# EAGLE design sense-amp (EAGLE 6.6.0)
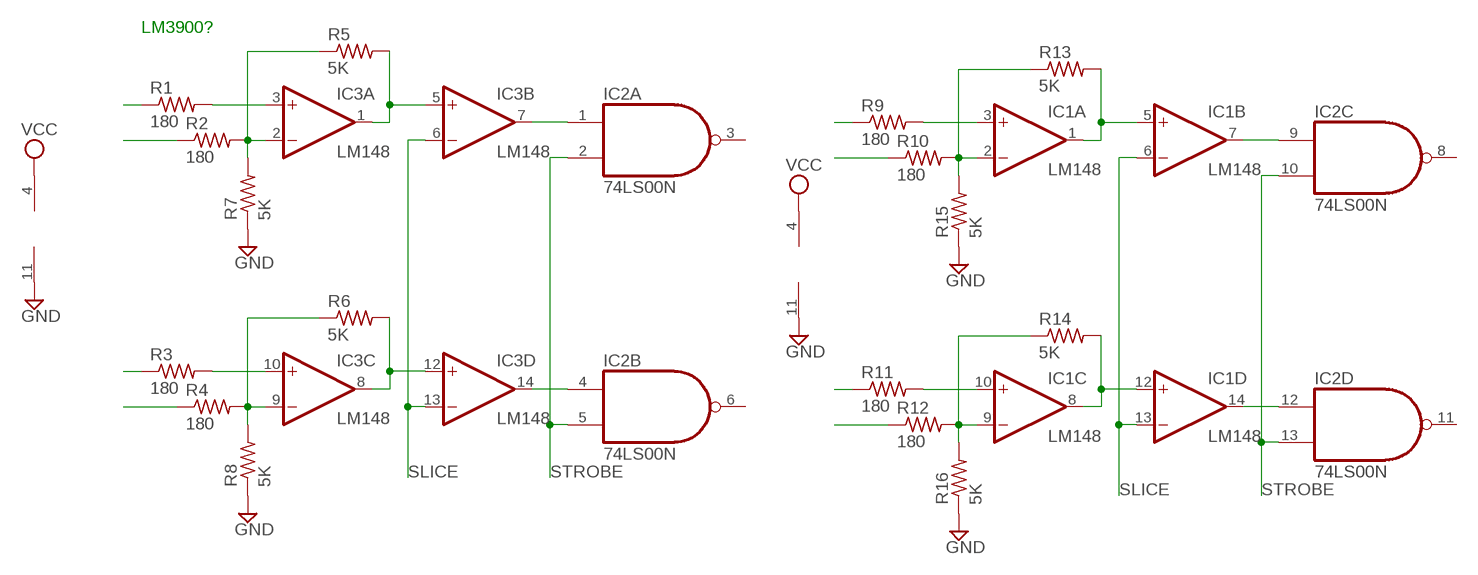
[diagram p0: schematic, sheet 1]

## Parts
IC1  LM148  OP11P  [DIL14]
IC2  74LS00N  [DIL14]
IC3  LM148  OP11P  [DIL14]
R1  180  R-US_0207/10  [0207/10]
R2  180  R-US_0207/10  [0207/10]
R3  180  R-US_0207/10  [0207/10]
R4  180  R-US_0207/10  [0207/10]
R5  5K  R-US_0207/10  [0207/10]
R6  5K  R-US_0207/10  [0207/10]
R7  5K  R-US_0207/10  [0207/10]
R8  5K  R-US_0207/10  [0207/10]
R9  180  R-US_0207/10  [0207/10]
R10  180  R-US_0207/10  [0207/10]
R11  180  R-US_0207/10  [0207/10]
R12  180  R-US_0207/10  [0207/10]
R13  5K  R-US_0207/10  [0207/10]
R14  5K  R-US_0207/10  [0207/10]
R15  5K  R-US_0207/10  [0207/10]
R16  5K  R-US_0207/10  [0207/10]

## Nets
GND: IC1.11(P:V-) IC3.11(P:V-) R7.1 R8.1 R15.1 R16.1
N$1: IC3.8(C:OUT) IC3.12(D:+IN) R6.2
N$2: IC3.1(A:OUT) IC3.5(B:+IN) R5.2
N$3: R1.1
N$4: R2.1
N$5: R3.1
N$6: R4.1
N$7: IC3.9(C:-IN) R4.2 R6.1 R8.2
N$8: IC3.10(C:+IN) R3.2
N$9: IC3.2(A:-IN) R2.2 R5.1 R7.2
N$10: IC3.3(A:+IN) R1.2
N$11: IC1.8(C:OUT) IC1.12(D:+IN) R14.2
N$12: IC1.1(A:OUT) IC1.5(B:+IN) R13.2
N$13: R9.1
N$14: R10.1
N$15: R11.1
N$16: R12.1
N$17: IC1.9(C:-IN) R12.2 R14.1 R16.2
N$18: IC1.10(C:+IN) R11.2
N$19: IC1.2(A:-IN) R10.2 R13.1 R15.2
N$20: IC1.3(A:+IN) R9.2
N$21: IC2.1(A:I0) IC3.7(B:OUT)
N$22: IC2.4(B:I0) IC3.14(D:OUT)
N$23: IC1.14(D:OUT) IC2.12(D:I0)
N$24: IC1.7(B:OUT) IC2.9(C:I0)
SLICE: IC1.6(B:-IN) IC1.13(D:-IN) IC3.6(B:-IN) IC3.13(D:-IN)
STROBE: IC2.2(A:I1) IC2.5(B:I1) IC2.10(C:I1) IC2.13(D:I1)
VCC: IC1.4(P:V+) IC3.4(P:V+)
Unconnected: IC2.3(A:O) IC2.6(B:O) IC2.8(C:O) IC2.11(D:O)

## Notes on the sheet
- LM3900?

## Power pins joined to a net without a drawn wire
GND: IC2.7(P:GND)
VCC: IC2.14(P:VCC)

## Library data of the parts
IC1 IC3 = linear:OP11: Quad Low-Offset Low-Power OP AMP The OP-11 is pin compatible with the OP-400 , LM148, HA4741, RM4156, and LT1014 operational amplifiers source http://products.analog.com/products/info.asp?product=OP400
IC2 = 74xx-us:74*00: Quad 2-input NAND gate
R1-R16 = rcl:R-US_: RESISTOR, American symbol

## Board
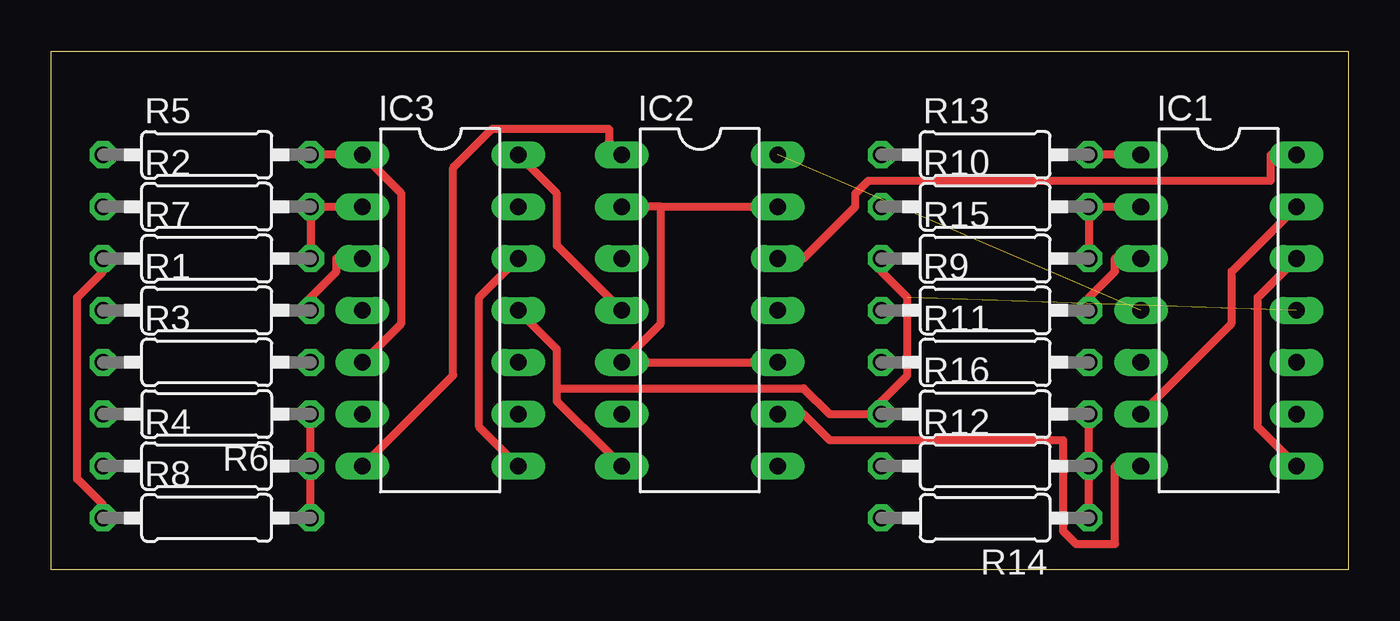
[diagram p1: board, top side]
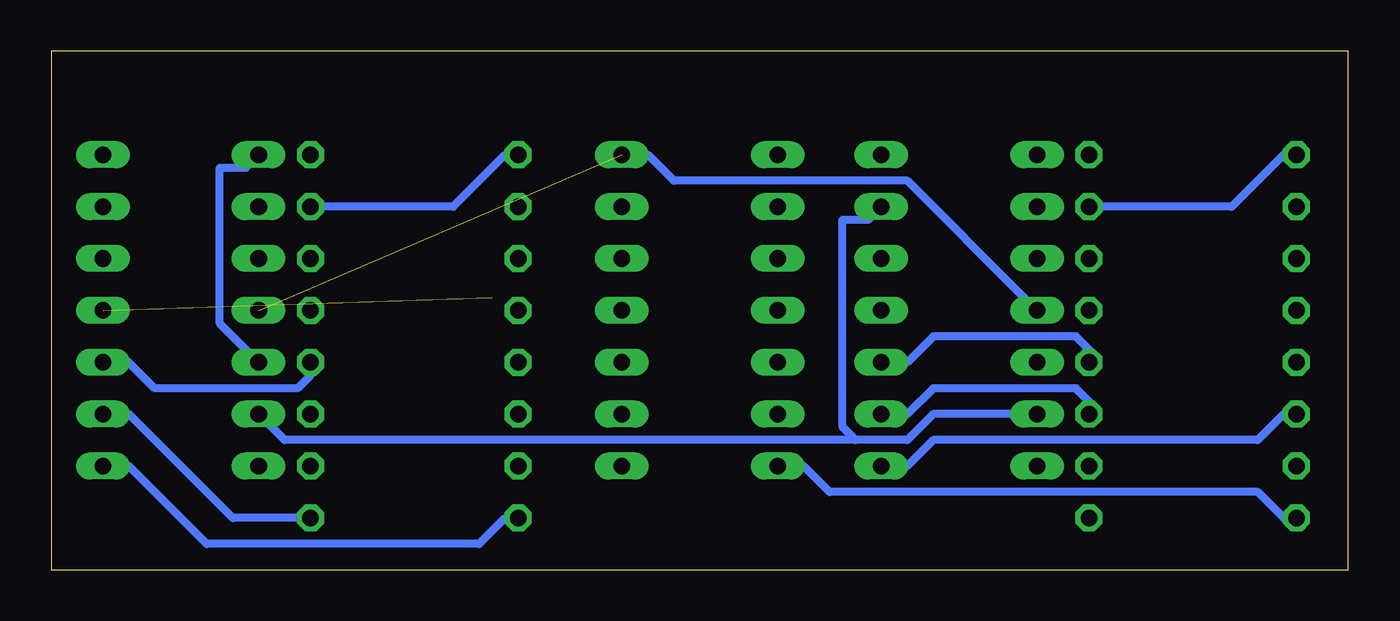
[diagram p2: board, bottom side, seen from below]

Size 63.5 x 25.4 mm. Coordinates in mm from the lower left corner, seen from the top.
Outline: 0,0 0,25.4 63.5,25.4 63.5,0 0,0
Copper layers (1*16): Top 0.035mm / dielectric 1.5mm / Bottom 0.035mm
Design rules "15mils": minimum track width 15mil, minimum drill 24mil, track to track 15mil, track to pad 10mil, pad to pad 10mil, via to via 10mil, smd to smd 10mil, copper to edge 25mil, drill to drill 10mil, minimum pad ring 10mil, minimum via ring 8mil, stop-mask expansion 0mil, vias tented up to drill 0mil, thermal gap 10mil

### Footprints (pad centres in the part's own frame; a part is rotated, then mirrored left to right if it is on the bottom)
DIL14 = drill 0.813 long: 1 -7.62,-3.81; 2 -5.08,-3.81; 3 -2.54,-3.81; 4 0,-3.81; 5 2.54,-3.81; 6 5.08,-3.81; 7 7.62,-3.81; 8 7.62,3.81; 9 5.08,3.81; 10 2.54,3.81; 11 0,3.81; 12 -2.54,3.81; 13 -5.08,3.81; 14 -7.62,3.81
0207/10 = drill 0.813 octagon: 1 -5.08,0; 2 5.08,0

### Placement (x,y rotation side)
IC1  57.15,12.7 270 top
IC2  31.75,12.7 270 top
IC3  19.05,12.7 270 top
R1  7.62,12.7 0 top
R2  7.62,17.78 0 top
R3  7.62,10.16 0 top
R4  7.62,5.08 0 top
R5  7.62,20.32 0 top
R6  7.62,7.62 180 top
R7  7.62,15.24 0 top
R8  7.62,2.54 0 top
R9  45.72,12.7 0 top
R10  45.72,17.78 0 top
R11  45.72,10.16 0 top
R12  45.72,5.08 0 top
R13  45.72,20.32 0 top
R14  45.72,2.54 180 top
R15  45.72,15.24 0 top
R16  45.72,7.62 0 top

### Tracks (layer width: path | path; a pad name or v marks a point on that pad's centre or on a via)
GND  (1 unrouted)
  Top 0.381: R8.1 2.54,3.17 1.27,4.45 1.27,13.34 2.54,14.61 R7.1 | R15.1 40.64,14.61 41.91,13.34 41.91,9.53 40.64,8.26 R16.1 40.01,7.62 38.1,7.62 36.83,8.89 24.77,8.89 | 24.77,8.89 24.77,10.79 23.5,12.06 IC3.11 | 24.77,8.89 24.77,8.26 27.3,5.71 IC2.7
  Bottom 0.381: R8.1 3.17,2.54 4.45,3.81 25.4,3.81 26.67,5.08 IC2.7
N$1
  Top 0.381: IC3.12 22.23,14.61 20.95,13.34 20.95,6.99 22.23,5.71 IC3.8
  Bottom 0.381: R6.2 3.17,7.62 4.45,6.35 20.32,6.35 21.59,5.08 IC3.8
N$2
  Top 0.381: R5.2 13.34,20.32 13.97,20.32 IC3.1 15.88,19.68 17.14,18.41 17.14,12.06 15.88,10.79 IC3.5
N$7
  Top 0.381: R8.2 12.7,3.17 12.7,4.45 R4.2 12.7,5.71 12.7,6.99 R6.1
  Bottom 0.381: IC3.9 21.59,7.62 20.32,8.89 13.34,8.89 12.7,8.26 R6.1
N$8
  Bottom 0.381: R3.2 12.7,10.79 13.34,11.43 20.32,11.43 21.59,10.16 IC3.10
N$9
  Top 0.381: R7.2 12.7,15.88 12.7,17.14 R2.2 13.34,17.78 13.97,17.78 IC3.2
  Bottom 0.381: R5.1 3.17,20.32 5.71,17.78 12.06,17.78 R2.2
N$10
  Top 0.381: R1.2 12.7,13.34 13.97,14.61 13.97,15.24 IC3.3
N$11
  Top 0.381: IC1.12 60.33,14.61 59.05,13.34 59.05,6.99 60.33,5.71 IC1.8
  Bottom 0.381: R14.2 41.27,2.54 42.55,1.27 55.88,1.27 59.69,5.08 IC1.8
N$12
  Top 0.381: R13.2 51.44,20.32 52.07,20.32 IC1.1
  Bottom 0.381: IC1.5 53.98,10.79 55.24,12.06 55.24,19.68 53.98,19.68 IC1.1
N$17
  Top 0.381: R14.1 50.8,3.17 50.8,4.45 R12.2 50.8,5.71 50.8,6.99 R16.2
  Bottom 0.381: IC1.9 59.69,7.62 54.61,2.54 51.44,2.54 R14.1
N$18
  Bottom 0.381: R11.2 50.8,9.53 51.44,8.89 58.42,8.89 59.69,10.16 IC1.10
N$19
  Top 0.381: R15.2 50.8,15.88 50.8,17.14 R10.2 51.44,17.78 52.07,17.78 IC1.2
  Bottom 0.381: R13.1 41.27,20.32 43.81,17.78 50.16,17.78 R10.2
N$20
  Top 0.381: R9.2 50.8,13.34 52.07,14.61 52.07,15.24 IC1.3
N$21
  Top 0.381: IC3.7 15.88,5.71 19.68,9.53 19.68,19.68 21.59,21.59 27.3,21.59 27.3,20.95 IC2.1
N$22
  Top 0.381: IC2.4 27.3,13.34 24.77,15.88 24.77,18.41 23.5,19.68 IC3.14
N$23
  Top 0.381: IC2.12 36.83,15.24 39.37,17.78 39.37,18.41 40.01,19.05 59.69,19.05 59.69,20.32 IC1.14
N$24
  Top 0.381: IC2.9 36.83,7.62 38.1,6.35 49.53,6.35 49.53,1.91 50.16,1.27 52.07,1.27 52.07,5.08 IC1.7
SLICE
  Top 0.381: IC1.6 53.98,8.26 57.78,12.06 57.78,14.61 60.33,17.14 IC1.13
  Bottom 0.381: 24.13,6.35 21.59,6.35 20.32,7.62 16.51,7.62 IC3.6 | 24.13,6.35 24.77,6.99 24.77,17.14 23.5,17.14 IC3.13 | 24.13,6.35 52.07,6.35 52.7,6.99 IC1.6
STROBE
  Top 0.381: IC2.10 34.29,10.16 29.21,10.16 IC2.5 28.57,10.79 29.84,12.06 29.84,17.78 | 29.84,17.78 34.29,17.78 IC2.13 | 29.84,17.78 29.21,17.78 IC2.2
VCC  (1 unrouted)
  Bottom 0.381: IC3.4 15.88,13.34 21.59,19.05 33.02,19.05 34.29,20.32 IC2.14